# EAGLE design smart prototyping2 (EAGLE 7.3.0)
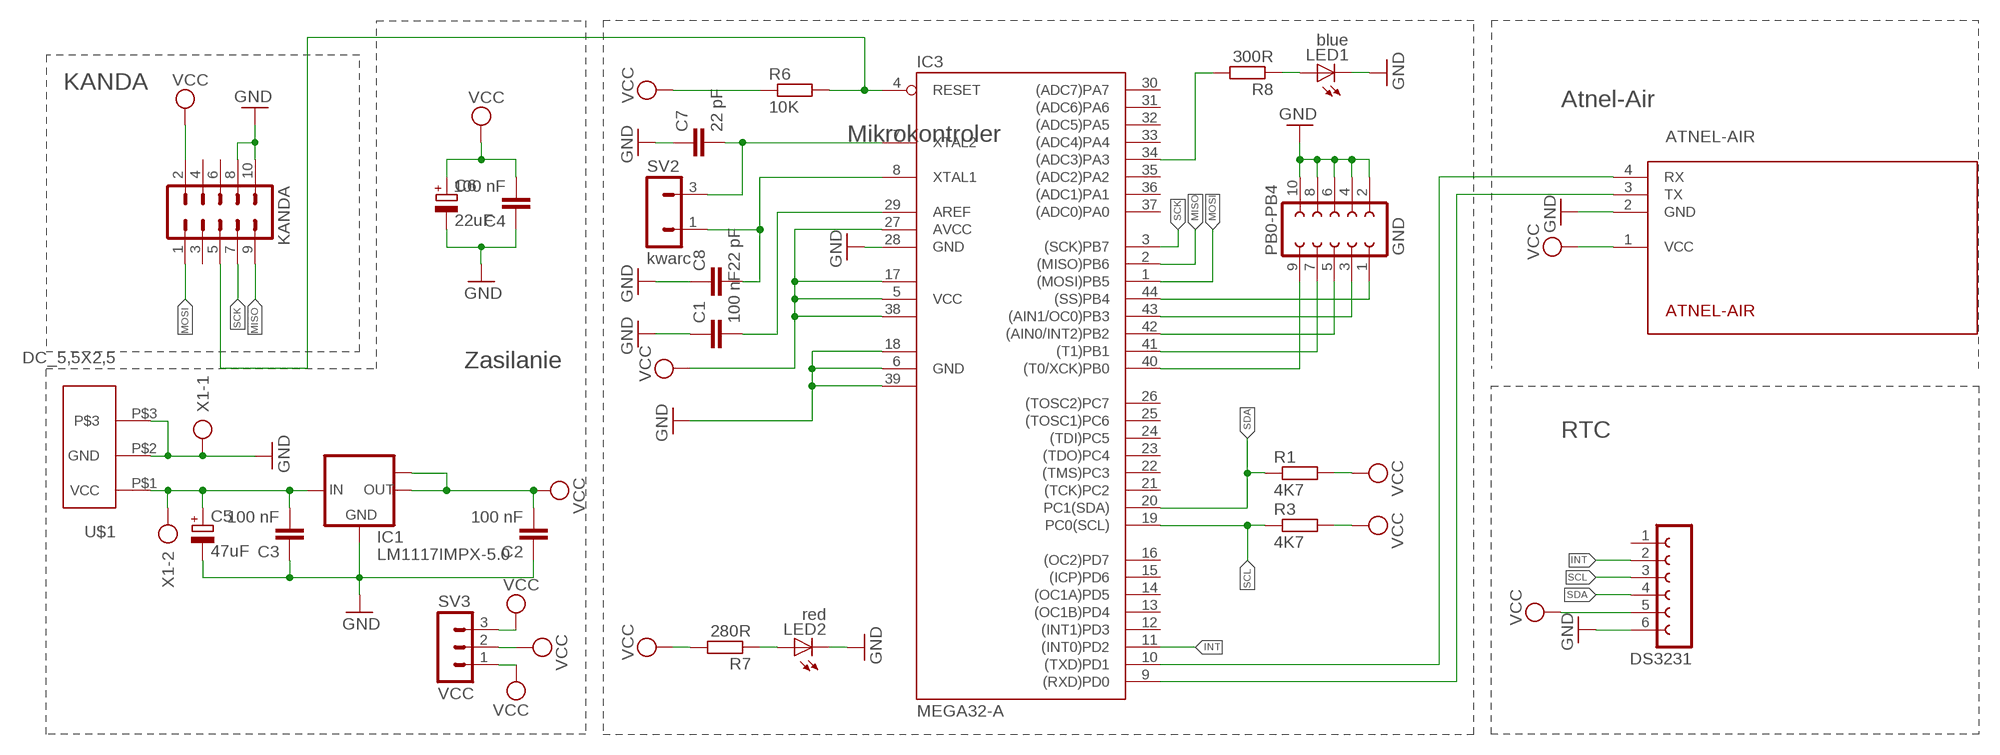
[diagram p0: schematic, sheet 1]

## Parts
ATNEL-AIR  ATNEL-AIR  [ATNEL-AIR]
C1  100 nF  C-EUC0805  [C0805]
C2  100 nF  C-EUC0805  [C0805]
C3  100 nF  C-EUC0805  [C0805]
C4  100 nF  C-EUC0805  [C0805]
C5  47uF  CPOL-EUB45181A  [B45181A]
C6  22uF  CPOL-EUB45181A  [B45181A]
C7  22 pF  C-EUC0805  [C0805]
C8  22 pF  C-EUC0805  [C0805]
DS3231  FE06-1  [FE06]
IC1  LM1117IMPX-5.0  [SOT223]
IC3  MEGA32-A  [TQFP44]
KANDA  ML10  [ML10]
LED1  blue  LEDCHIPLED_1206  [CHIPLED_1206]
LED2  red  LEDCHIPLED_1206  [CHIPLED_1206]
PB0-PB4  GND  FE05-2  [FE05-2]
R1  4K7  R-EU_R1206W  [R1206W]
R3  4K7  R-EU_R1206W  [R1206W]
R6  10K  R-EU_R1206W  [R1206W]
R7  280R  R-EU_R1206W  [R1206W]
R8  300R  R-EU_R1206W  [R1206W]
SV2  kwarc  MA03-1  [MA03-1]
SV3  VCC  MA03-1  [MA03-1]
U$1  DC_5,5X2,5  [DC_5,5X2,5]
X1  AK500/2  [AK500/2]

## Nets
GND: ATNEL-AIR.2(GND) C1.1 C2.1 C3.1 C4.1 C5.- C6.- C7.1 C8.1 DS3231.6 IC1.1(GND) IC3.6(GND) IC3.18(GND1) IC3.28(GND) IC3.39(GND2) KANDA.8 KANDA.10 LED1.C LED2.C PB0-PB4.2 PB0-PB4.4 PB0-PB4.6 PB0-PB4.8 PB0-PB4.10 U$1.P$2(GND) U$1.P$3 X1.1
INT: DS3231.2 IC3.11((INT0)PD2)
MISO: IC3.2((MISO)PB6) KANDA.9
MOSI: IC3.1((MOSI)PB5) KANDA.1
N$1: ATNEL-AIR.4(RX) IC3.10((TXD)PD1)
N$2: ATNEL-AIR.3(TX) IC3.9((RXD)PD0)
N$3: C1.2 IC3.29(AREF)
N$4: IC3.44((SS)PB4) PB0-PB4.1
N$5: IC3.43((AIN1/OC0)PB3) PB0-PB4.3
N$6: C3.2 C5.+ IC1.3(IN) U$1.P$1(VCC) X1.2
N$7: IC3.42((AIN0/INT2)PB2) PB0-PB4.5
N$8: IC3.41((T1)PB1) PB0-PB4.7
N$9: IC3.40((T0/XCK)PB0) PB0-PB4.9
N$10: C7.2 IC3.7(XTAL2) SV2.3
N$11: C8.2 IC3.8(XTAL1) SV2.1
N$12: LED2.A R7.1
N$16: LED1.A R8.1
N$17: IC3.34((ADC3)PA3) R8.2
RST: IC3.4(RESET) KANDA.5 R6.2
SCK: IC3.3((SCK)PB7) KANDA.7
SCL: DS3231.3 IC3.19(PC0(SCL)) R3.1
SDA: DS3231.4 IC3.20(PC1(SDA)) R1.1
VCC: ATNEL-AIR.1(VCC) C2.2 C4.2 C6.+ DS3231.5 IC1.2(OUT) IC1.TAB(OUT1) IC3.5(VCC) IC3.17(VCC1) IC3.27(AVCC) IC3.38(VCC2) KANDA.2 R1.2 R3.2 R6.1 R7.2 SV3.1 SV3.2 SV3.3
Unconnected: DS3231.1 IC3.12((INT1)PD3) IC3.13((OC1B)PD4) IC3.14((OC1A)PD5) IC3.15((ICP)PD6) IC3.16((OC2)PD7) IC3.21((TCK)PC2) IC3.22((TMS)PC3) IC3.23((TDO)PC4) IC3.24((TDI)PC5) IC3.25((TOSC1)PC6) IC3.26((TOSC2)PC7) IC3.30((ADC7)PA7) IC3.31((ADC6)PA6) IC3.32((ADC5)PA5) IC3.33((ADC4)PA4) IC3.35((ADC2)PA2) IC3.36((ADC1)PA1) IC3.37((ADC0)PA0) KANDA.3 KANDA.4 KANDA.6

## Notes on the sheet
- KANDA
- Atnel-Air
- Mikrokontroler
- Zasilanie
- RTC

## Library data of the parts
ATNEL-AIR = ATNEL-WIFI232-T:ATNEL-AIR
C1-C4 C7 C8 = rcl:C-EU: CAPACITOR, European symbol
C5 C6 = rcl:CPOL-EU: POLARIZED CAPACITOR, European symbol
DS3231 = con-lsta:FE06-1: FEMALE HEADER; OC_FARNELL: unknown; OC_NEWARK: unknown
IC1 = lm1117:LM1117IMPX-*
IC3 = atmel:MEGA32: MICROCONTROLLER 32 Kbytes FLASH 2 Kbytes SRAM 1 Kbytes EEPROM USART 8-channel 10 bit ADC Source: www.atmel.com .. doc2503.pdf; MPN: ATMEGA32-16AU; OC_FARNELL: 9171274; OC_NEWARK: 69K6677
KANDA = con-harting-ml:ML10: HARTING; OC_FARNELL: unknown; OC_NEWARK: unknown
LED1 LED2 = adafruit:LED: LED OSRAM: - CHIPLED LG R971, LG N971, LY N971, LG Q971, LY Q971, LO R971, LY R971 LH N974, LH R974 LS Q976, LO Q976, LY Q976 LO Q996 - Hyper CHIPLED LW Q18S LB Q993, LB Q99A, LB R99A - SideLED LS A670, LO A670, LY A670, LG A670, LP A670 LB A673, LV A673, LT A673, LW A673 LH A674 LY A675 LS A676, LA A676, LO A676, LY A676, LW A676 LS A679, LY A679, LG A679 - Hyper Micro SIDELED® LS Y876, LA Y876, LO Y876, LY Y876 LT Y87S - SmartLED LW L88C, LW L88S LB L89C, LB L89S, LG L890 LS L89K, LO L89K, LY L89K LS L896, LA L896, LO L896, LY L896 - TOPLED LS T670, LO T670, LY T670, LG T670, LP T670 LSG T670, LSP T670, LSY T670, LOP T670, LYG T670 LG T671, LOG T671, LSG T671 LB T673, LV T673, LT T673, LW T673 LH T674 LS T676, LA T676, LO T676, LY T676, LB T676, LH T676, LSB T676, LW T676 LB T67C, LV T67C, LT T67C, LS T67K, LO T67K, LY T67K, LW E67C LS E67B, LA E67B, LO E67B, LY E67B, LB E67C, LV E67C, LT E67C LW T67C LS T679, LY T679, LG T679 LS T770, LO T770, LY T770, LG T770, LP T770 LB T773, LV T773, LT T773, LW T773 LH T774 LS E675, LA E675, LY E675, LS T675 LS T776, LA T776, LO T776, LY T776, LB T776 LHGB T686 LT T68C, LB T68C - Hyper Mini TOPLED® LB M676 - Mini TOPLED Santana® LG M470 LS M47K, LO M47K, LY M47K Source: http://www.osram.convergy.de/
PB0-PB4 = con-lsta:FE05-2: FEMALE HEADER; OC_FARNELL: unknown; OC_NEWARK: unknown
R1 R3 R6-R8 = resistor:R-EU_: RESISTOR, European symbol
SV2 = con-lstb-wachcio:MA03-1: PIN HEADER; OC_FARNELL: unknown; OC_NEWARK: unknown
SV3 = con-lstb:MA03-1: PIN HEADER; OC_FARNELL: unknown; OC_NEWARK: unknown
U$1 = wachcio:DC_5,5X2,5
X1 = con-ptr500:AK500/2: CONNECTOR; OC_FARNELL: unknown; OC_NEWARK: unknown

## Board
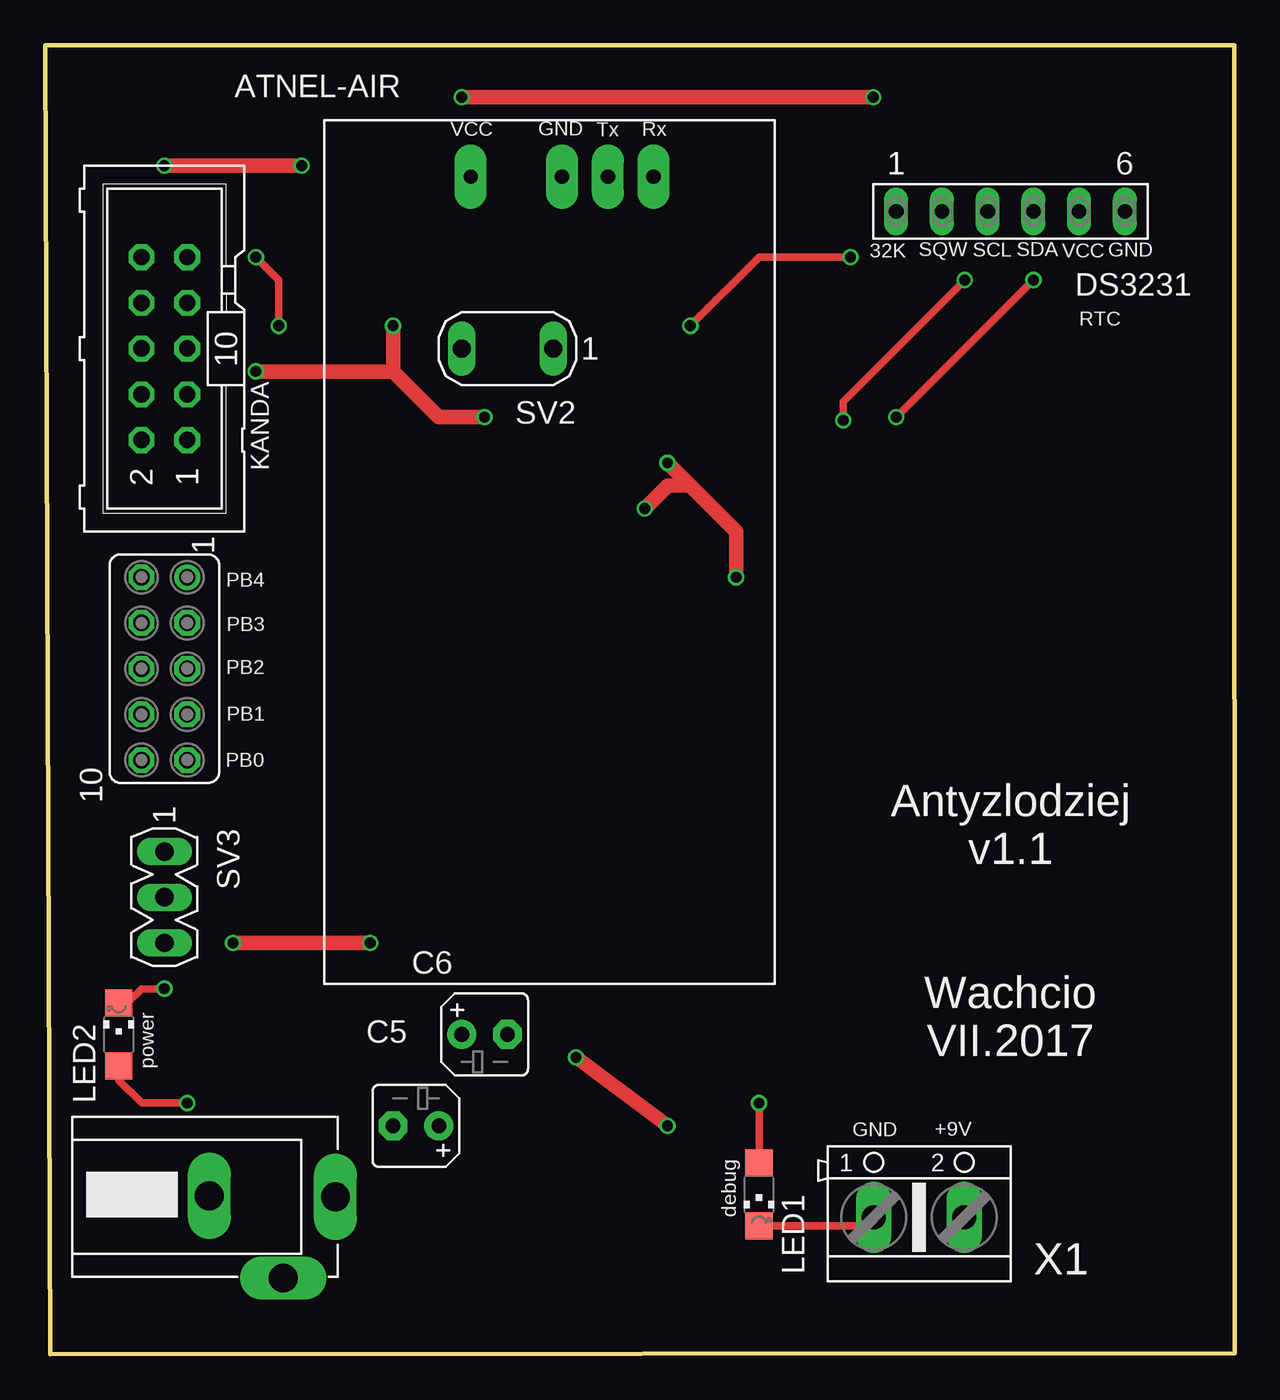
[diagram p1: board, top side]
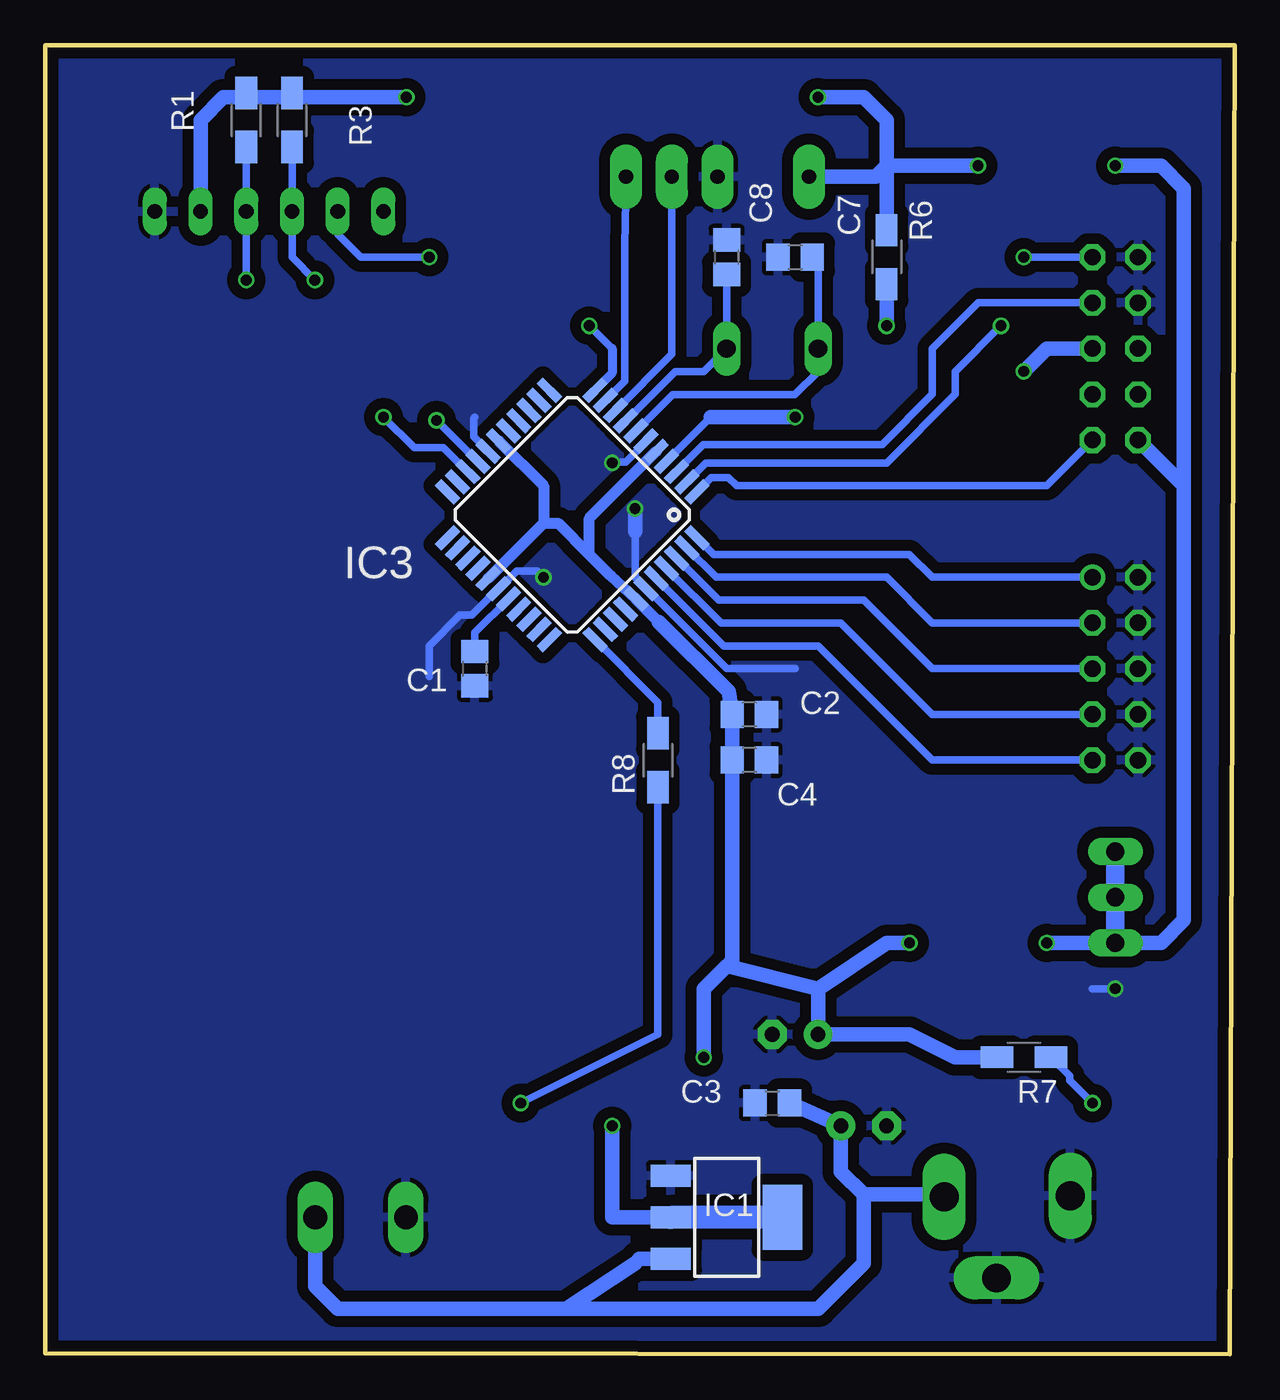
[diagram p2: board, bottom side, seen from below]

Size 66.07 x 72.75 mm. Coordinates in mm from the lower left corner, seen from the top.
Outline: 62.51,0 66.07,0.08
Outline: 66.07,0.08 0.28,0 0,72.75 66.04,72.75 66.07,0.08
Copper layers (1*16): Top 0.035mm / dielectric 1.5mm / Bottom 0.035mm
Design rules "smart-prototyping": minimum track width 7mil, minimum drill 12mil, track to track 7mil, track to pad 7mil, pad to pad 7mil, via to via 7mil, smd to smd 0mil, copper to edge 20mil, drill to drill 10mil, minimum pad ring 10mil, minimum via ring 6mil, stop-mask expansion 2mil, vias tented up to drill 25mil, thermal gap 10mil

### Footprints (pad centres in the part's own frame; a part is rotated, then mirrored left to right if it is on the bottom)
ATNEL-AIR = drill 0.8 pad 1.778 long: 1 3.15,8.12; 2 3.15,13.2; 3 3.15,15.74; 4 3.15,18.28
C0805 = smd 1.3 x 1.5: 1 -0.95,0; 2 0.95,0
B45181A = drill 0.813 pad 1.6: + -1.27,0 | drill 0.813 pad 1.6 octagon: - 1.27,0
FE06 = drill 0.813 long: 1 -6.35,0; 2 -3.81,0; 3 -1.27,0; 4 1.27,0; 5 3.81,0; 6 6.35,0
SOT223 = smd 1.219 x 2.235: 1 -2.311,-3.099; 2 0,-3.099; 3 2.311,-3.099 | smd 3.6 x 2.2: TAB 0,3.099
TQFP44 = smd 1.5 x 0.5: 1 -5.8,4; 2 -5.8,3.2; 3 -5.8,2.4; 4 -5.8,1.6; 5 -5.8,0.8; 6 -5.8,0; 7 -5.8,-0.8; 8 -5.8,-1.6; 9 -5.8,-2.4; 10 -5.8,-3.2; 11 -5.8,-4; 23 5.8,-4; 24 5.8,-3.2; 25 5.8,-2.4; 26 5.8,-1.6; 27 5.8,-0.8; 28 5.8,0; 29 5.8,0.8; 30 5.8,1.6; 31 5.8,2.4; 32 5.8,3.2; 33 5.8,4 | smd 0.5 x 1.5: 12 -4,-5.8; 13 -3.2,-5.8; 14 -2.4,-5.8; 15 -1.6,-5.8; 16 -0.8,-5.8; 17 0,-5.8; 18 0.8,-5.8; 19 1.6,-5.8; 20 2.4,-5.8; 21 3.2,-5.8; 22 4,-5.8; 34 4,5.8; 35 3.2,5.8; 36 2.4,5.8; 37 1.6,5.8; 38 0.8,5.8; 39 0,5.8; 40 -0.8,5.8; 41 -1.6,5.8; 42 -2.4,5.8; 43 -3.2,5.8; 44 -4,5.8
ML10 = drill 0.914 octagon: 1 -5.08,-1.27; 2 -5.08,1.27; 3 -2.54,-1.27; 4 -2.54,1.27; 5 0,-1.27; 6 0,1.27; 7 2.54,-1.27; 8 2.54,1.27; 9 5.08,-1.27; 10 5.08,1.27
CHIPLED_1206 = smd 1.5 x 1.5: A 0,-1.75; C 0,1.75
FE05-2 = drill 0.914: 1 -5.08,1.27 | drill 0.914 octagon: 2 -5.08,-1.27; 3 -2.54,1.27; 4 -2.54,-1.27; 5 0,1.27; 6 0,-1.27; 7 2.54,1.27; 8 2.54,-1.27; 9 5.08,1.27; 10 5.08,-1.27
R1206W = smd 1.8 x 1.2: 1 -1.499,0; 2 1.499,0
MA03-1 = drill 1.016 long: 1 -2.54,0; 3 2.54,0
MA03-1' = drill 1.016 long: 1 -2.54,0; 2 0,0; 3 2.54,0
DC_5,5X2,5 = drill 1.6 long: P$1 14.605,4.445; P$2 11.7,-0.07; P$3 7.6,4.5
AK500/2 = drill 1.321 long: 1 -2.515,0; 2 2.515,0

### Placement (x,y rotation side)
ATNEL-AIR  15.52,68.58 270 top
C1  42.19,38.1 90 bottom
C2  26.95,35.56 180 bottom
C3  25.68,13.97 0 bottom
C4  26.95,33.02 180 bottom
C5  20.6,12.7 180 top
C6  24.41,17.78 0 top
C7  24.41,60.96 0 bottom
C8  28.22,60.96 270 bottom
DS3231  53.62,63.5 0 top
IC1  28.22,7.62 270 bottom
IC3  36.79,46.64 225 bottom
KANDA  6.63,55.88 90 top
LED1  39.65,8.89 180 top
LED2  4.09,17.78 0 top
PB0-PB4  6.63,38.1 270 top
R1  54.89,68.58 90 bottom
R3  52.35,68.58 90 bottom
R6  19.33,60.96 270 bottom
R7  11.71,16.51 180 bottom
R8  32.03,33.02 90 bottom
SV2  25.68,55.88 180 top
SV3  VCC  [MA03-1']  6.63,25.4 270 top
U$1  1.52,4.32 0 top
X1  48.54,7.62 0 top

### Tracks (layer width: path | path; a pad name or v marks a point on that pad's centre or on a via)
GND  (via drill 0.6)
  Top 0.406: LED2.C 4.57,19.53 5.36,20.32 v6.63,20.32 | LED1.C 45.54,7.14 X1.1
  Top 0.813: v38.38,43.18 38.38,45.72 35.84,48.26 | 35.84,48.26 34.57,48.26 v33.3,46.99 | v34.57,49.53 35.84,48.26
  Bottom 0.406: IC3.18 41.46,50.19 42.27,51 42.27,51.99 42.19,52.07 | 41.46,50.17 41.43,50.17 | 44.73,37.67 44.73,39.37 43.03,41.07 42.37,41.07 IC3.28 40.87,42.54 39.88,43.54 38.74,43.54 v38.38,43.18 | 33.3,43.18 33.3,43.16 IC3.39 | IC3.6 32.69,50.7 33.81,49.58 34.52,49.58 v34.57,49.53 | 24.41,38.1 28.22,38.1 33.3,43.18 | 33.3,43.18 33.3,45.72 | v6.63,20.32 7.9,20.32
  Bottom 0.5: IC3.18 41.46,50.17 | IC3.6
  Bottom 0.813: v33.3,46.99 33.3,45.72
  pour Bottom (isolate 0.61): 0.28,0 0.28,72.39 66.32,72.39 66.32,0
INT  (via drill 0.6)
  Top 0.406: v44.73,60.96 39.65,60.96 v35.84,57.15
  Bottom 0.406: v44.73,60.96 48.54,60.96 49.81,62.23 DS3231.2 | v35.84,57.15 34.57,55.88
  Bottom 0.5: 34.57,55.88 34.57,54.52 IC3.11
MISO  (via drill 0.6)
  Top 0.406: v11.71,60.96 12.98,59.69 v12.98,57.15
  Bottom 0.406: KANDA.9 v11.71,60.96 | IC3.2 29.38,49.53 19.33,49.53 15.52,53.34 15.52,54.61 v12.98,57.15
MOSI
  Bottom 0.406: 29.83,47.92 IC3.1 29.06,48.72 28.12,48.72 27.66,48.26 10.44,48.26 KANDA.1
N$1
  Bottom 0.406: IC3.10 34.93,53.01 33.86,54.08 33.86,61.56 ATNEL-AIR.4
N$2
  Bottom 0.406: ATNEL-AIR.3 31.26,55.57 IC3.9
N$3
  Bottom 0.406: IC3.29 42.19,40.11 C1.2
N$4
  Bottom 0.406: PB0-PB4.1 16.79,43.18 18.06,44.45 28.94,44.45 IC3.44
N$5
  Bottom 0.406: PB0-PB4.3 16.79,40.64 19.33,43.18 28.8,43.18 IC3.43
N$6
  Bottom 0.813: C3.2 C5.+ 21.87,10.16 20.6,8.89 | 20.6,8.89 16.26,8.89 U$1.P$1 | X1.2 51.05,3.78 49.81,2.54 37.11,2.54 | 37.11,2.54 23.14,2.54 20.6,5.08 20.6,8.89 | IC1.3 33.07,5.31 33.3,5.08 37.11,2.54
N$7
  Bottom 0.406: PB0-PB4.5 16.79,38.1 20.6,41.91 28.66,41.91 IC3.42
N$8
  Bottom 0.406: PB0-PB4.7 16.79,35.56 21.87,40.64 28.52,40.64 IC3.41
N$9
  Bottom 0.406: PB0-PB4.9 16.79,33.02 23.14,39.37 28.38,39.37 IC3.40
N$10
  Bottom 0.406: IC3.7 33.22,51.31 31.22,53.31 24.43,53.31 23.14,54.61 SV2.3 23.14,60.64 C7.2
N$11
  Bottom 0.406: IC3.8 33.8,51.88 31.06,54.61 29.49,54.61 SV2.1 C8.2
N$12  (via drill 0.6)
  Top 0.406: LED2.A 4.09,15.24 5.36,13.97 v7.9,13.97
  Bottom 0.406: v7.9,13.97 9.17,15.24 9.17,15.47 R7.1
N$16  (via drill 0.6)
  Top 0.406: LED1.A v39.65,13.97
  Bottom 0.406: R8.1 32.03,17.78 v39.65,13.97
N$17
  Bottom 0.406: R8.2 32.03,36.23 IC3.34
RST  (via drill 0.6)
  Top 0.813: v11.71,54.61 19.33,54.61 | 19.33,54.61 21.87,52.07 v24.41,52.07 | v19.33,57.15 19.33,54.61
  Bottom 0.406: 29.1,52.07 IC3.4
  Bottom 0.813: KANDA.5 10.44,55.88 v11.71,54.61 | v24.41,52.07 29.1,52.07 | R6.2 v19.33,57.15
SCK
  Bottom 0.406: IC3.3 30.99,49.07 29.51,50.55 19.58,50.55 16.79,53.34 16.79,55.88 14.25,58.42 KANDA.7
SCL  (via drill 0.6)
  Top 0.406: v44.32,51.89 44.32,52.93 v51.08,59.69
  Bottom 0.406: R3.1 DS3231.3 52.35,60.96 v51.08,59.69 | IC3.19 42.04,49.61 v44.32,51.89
SDA  (via drill 0.6)
  Top 0.406: v47.27,52.07 v54.89,59.69
  Bottom 0.406: R1.1 DS3231.4 v54.89,59.69 | IC3.20 42.62,49.05 43.94,50.37 45.57,50.37 v47.27,52.07
VCC  (via drill 0.6)
  Top 0.813: v23.14,69.85 v46,69.85 | v6.63,66.04 v14.25,66.04 | v34.57,12.7 v29.49,16.51 | v10.44,22.86 v18.06,22.86
  Bottom 0.406: 40.86,50.74 IC3.17 40.89,50.77 | IC3.27 41.46,43.13
  Bottom 0.61: 31.97,40.7 IC3.38 34.64,43.25 35.84,44.45 | 35.84,44.45 35.84,46.46 IC3.5 | 40.86,50.74 38.38,48.26 38.38,46.18 | 38.38,46.18 IC3.27 | 38.38,46.18 37.57,46.18 35.84,44.45
  Bottom 0.813: 2.82,48.26 2.82,24.13 4.09,22.86 SV3.3 v10.44,22.86 | 2.82,48.26 2.82,64.77 4.09,66.04 v6.63,66.04 | 54.66,69.85 R1.2 | 54.66,69.85 56.16,69.85 57.43,68.58 DS3231.5 | KANDA.2 2.82,48.26 | 19.33,66.04 19.33,68.58 20.6,69.85 v23.14,69.85 | 54.66,69.85 52.58,69.85 R3.2 52.12,69.85 v46,69.85 | R7.2 15.52,16.51 18.06,17.78 C6.+ 23.14,20.32 | v14.25,66.04 19.33,66.04 | R6.1 19.33,66.04 | IC1.2 34.57,7.62 v34.57,12.7 | v29.49,16.51 29.49,20.32 28.22,21.59 | ATNEL-AIR.1 19.94,65.43 19.33,66.04 | 23.14,20.32 19.33,22.86 v18.06,22.86 | 23.14,20.32 28.22,21.59 | 28.22,21.59 27.9,21.91 C4.2 C2.2 28.11,36.83 31.97,40.7
  Bottom 1.016: SV3.3 SV3.2 SV3.1
  Bottom 1.27: IC1.TAB IC1.2

### Text on the board
tPlace: VCC | GND | Tx | Rx | RTC | power | GND | +9V | debug
tNames: 32K | SQW | SCL | SDA | VCC | GND | PB4 | PB3 | PB2 | PB1 | PB0 | Antyzlodziej / v1.1 / / / Wachcio / VII.2017